# EAGLE design TriangleGenerator (EAGLE 7.3.0)
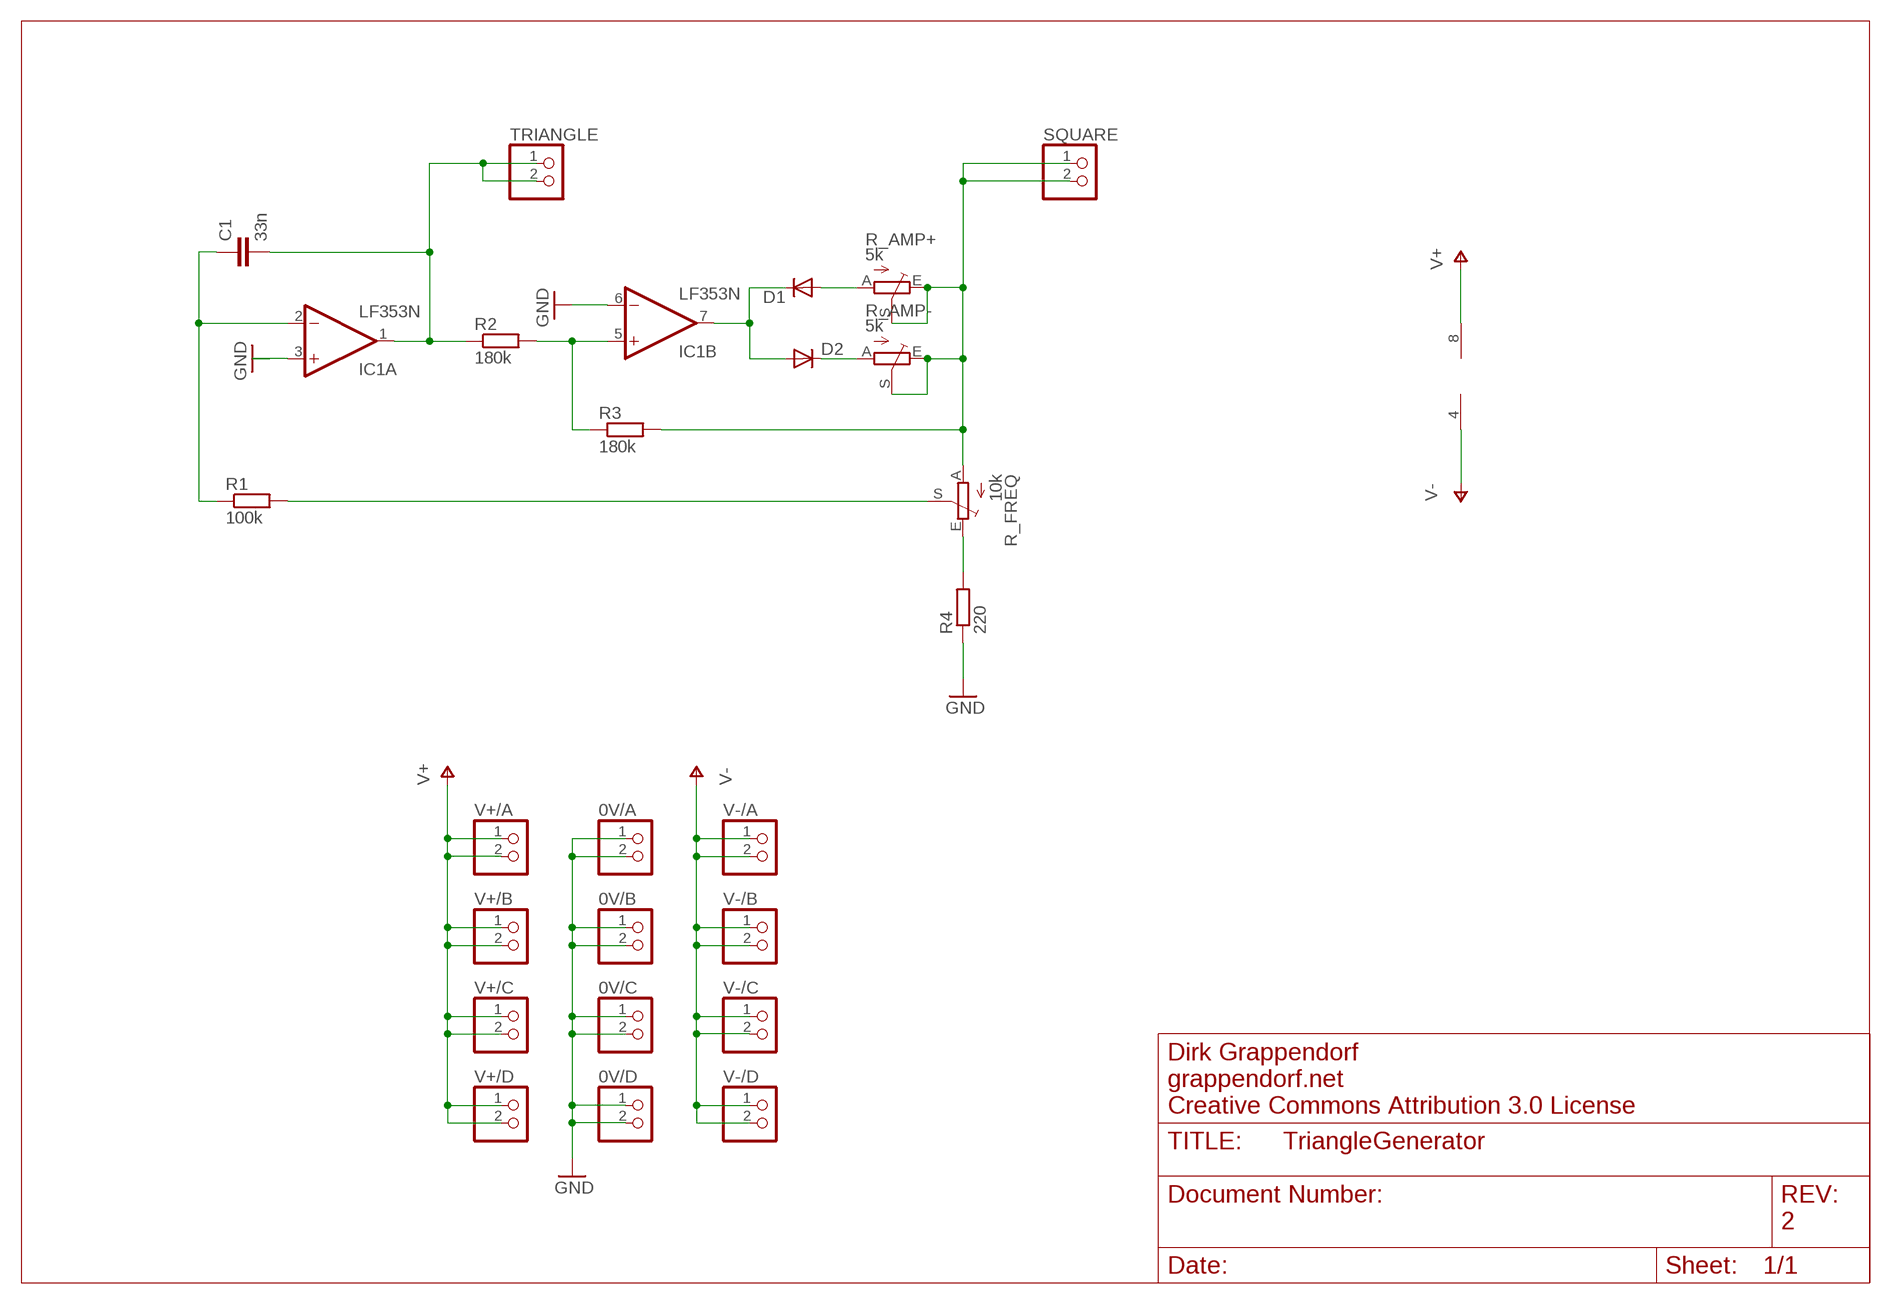
[diagram p0: schematic, sheet 1]

## Parts
0V/A  PINHD-1X2  [1X02]
0V/B  PINHD-1X2  [1X02]
0V/C  PINHD-1X2  [1X02]
0V/D  PINHD-1X2  [1X02]
C1  33n  C-EU025-025X050  [C025-025X050]
D1  DIODE1N4148  [DIODE-1N4148]
D2  DIODE1N4148  [DIODE-1N4148]
IC1  LF353N  [DIL08]
R1  100k  R-EU_0207/7  [0207/7]
R2  180k  R-EU_0207/7  [0207/7]
R3  180k  R-EU_0207/7  [0207/7]
R4  220  R-EU_0207/7  [0207/7]
R_AMP+  5k  TRIM_EU-LI15  [LI15]
R_AMP-  5k  TRIM_EU-LI15  [LI15]
R_FREQ  10k  TRIM_EU-LI15  [LI15]
SQUARE  PINHD-1X2  [1X02]
TRIANGLE  PINHD-1X2  [1X02]
V+/A  PINHD-1X2  [1X02]
V+/B  PINHD-1X2  [1X02]
V+/C  PINHD-1X2  [1X02]
V+/D  PINHD-1X2  [1X02]
V-/A  PINHD-1X2  [1X02]
V-/B  PINHD-1X2  [1X02]
V-/C  PINHD-1X2  [1X02]
V-/D  PINHD-1X2  [1X02]

## Nets
GND: 0V/A.1 0V/A.2 0V/B.1 0V/B.2 0V/C.1 0V/C.2 0V/D.1 0V/D.2 IC1.3(A:+IN) IC1.6(B:-IN) R4.1
N$1: C1.1 IC1.2(A:-IN) R1.1
N$2: C1.2 IC1.1(A:OUT) R2.1 TRIANGLE.1 TRIANGLE.2
N$3: IC1.5(B:+IN) R2.2 R3.1
N$4: D1.C D2.A IC1.7(B:OUT)
N$5: D1.A R_AMP+.A
N$6: D2.C R_AMP-.A
N$7: R3.2 R_AMP+.E R_AMP+.S R_AMP-.E R_AMP-.S R_FREQ.A SQUARE.1 SQUARE.2
N$10: R1.2 R_FREQ.S
N$11: R4.2 R_FREQ.E
V+: IC1.8(P:V+) V+/A.1 V+/A.2 V+/B.1 V+/B.2 V+/C.1 V+/C.2 V+/D.1 V+/D.2
V-: IC1.4(P:V-) V-/A.1 V-/A.2 V-/B.1 V-/B.2 V-/C.1 V-/C.2 V-/D.1 V-/D.2

## Notes on the sheet
- Dirk Grappendorf
- grappendorf.net
- Creative Commons Attribution 3.0 License
- 2

## Library data of the parts
0V/A 0V/B 0V/C 0V/D SQUARE TRIANGLE V+/A V+/B V+/C V+/D V-/A V-/B V-/C V-/D = pinhead:PINHD-1X2: PIN HEADER
C1 = rcl:C-EU: CAPACITOR, European symbol
D1 D2 = SparkFun:DIODE: Diode These are standard reverse protection diodes and small signal diodes. SMA package can handle up to about 1A. SOD-323 can handle about 200mA. What the SOD-323 package when ordering, there are some mfgs out there that are 5-pin packages.
IC1 = linear:LF353: OP AMP
R1-R4 = rcl:R-EU_: RESISTOR, European symbol
R_AMP+ R_AMP- R_FREQ = pot:TRIM_EU-: POTENTIOMETER

## Board
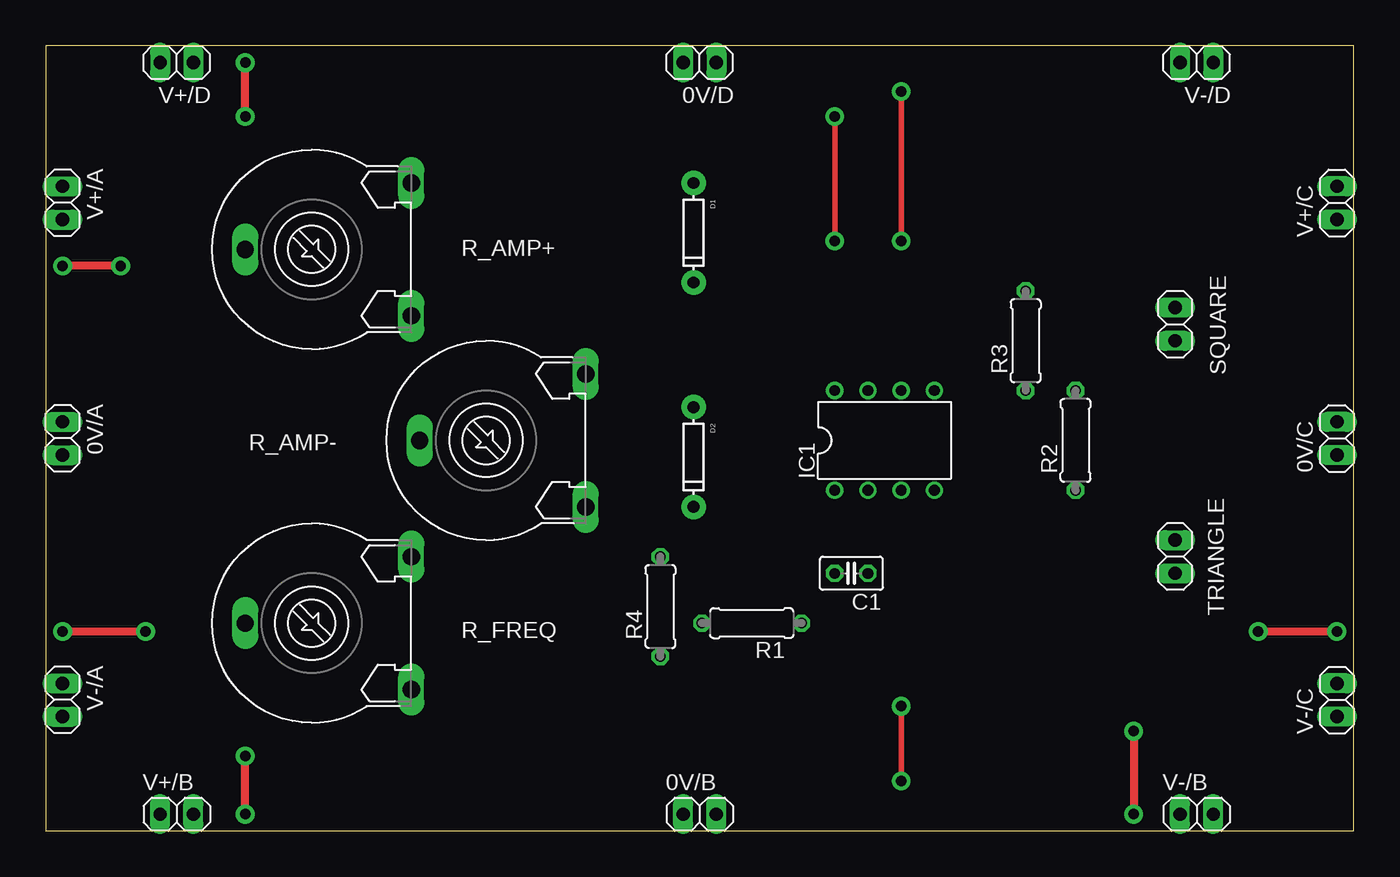
[diagram p1: board, top side]
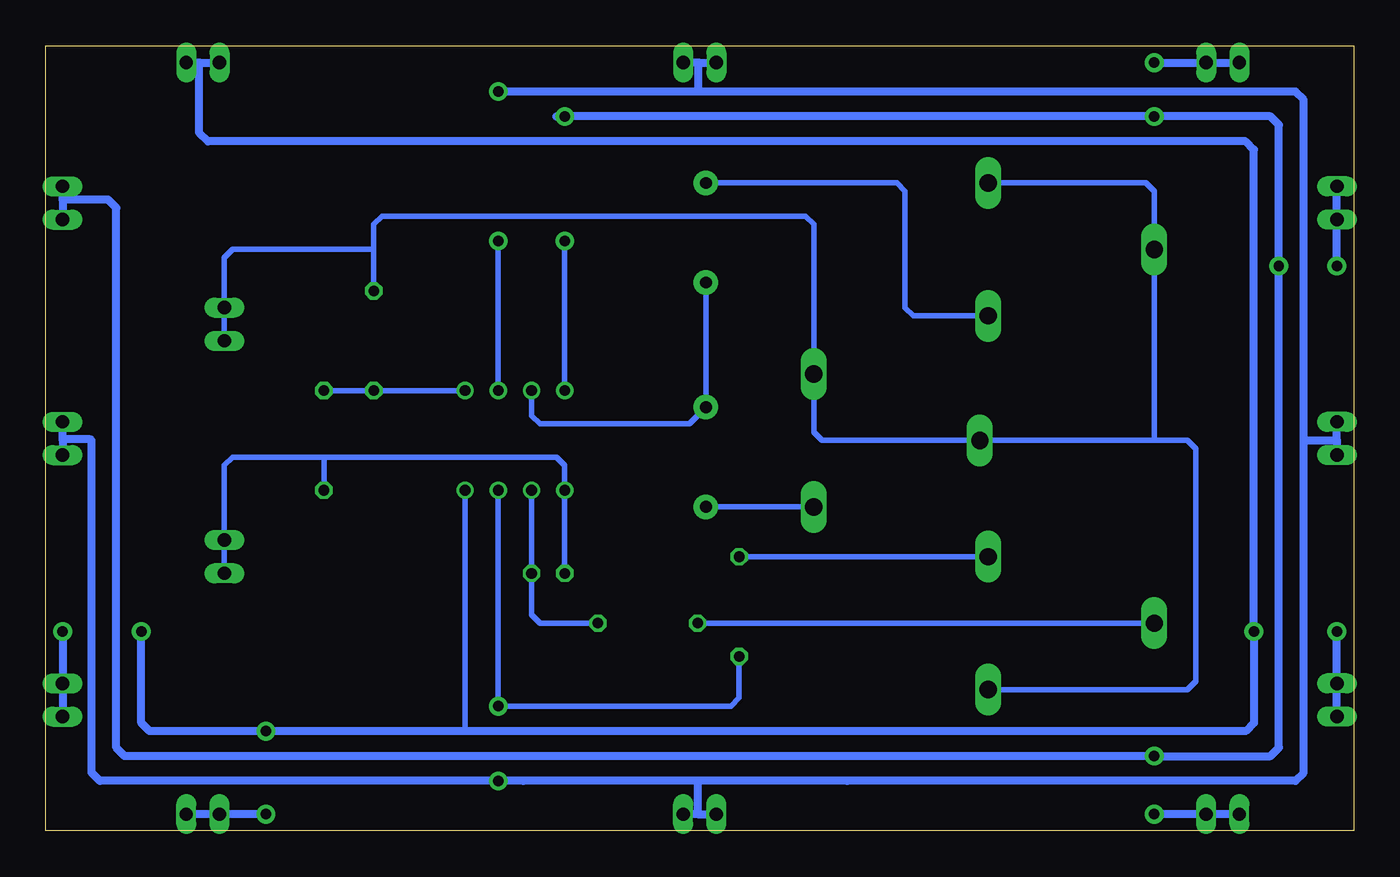
[diagram p2: board, bottom side, seen from below]

Size 100 x 60 mm. Coordinates in mm from the lower left corner, seen from the top.
Outline: 0,0 100,0 100,60 0,60 0,0
Copper layers (1*16): Top 0.035mm / dielectric 1.5mm / Bottom 0.035mm
Design rules "default *": minimum track width 10mil, minimum drill 24mil, track to track 8mil, track to pad 8mil, pad to pad 8mil, via to via 8mil, smd to smd 8mil, copper to edge 40mil, drill to drill 8mil, minimum pad ring 10mil, minimum via ring 8mil, stop-mask expansion 4mil, vias tented up to drill 0mil, thermal gap 10mil

### Footprints (pad centres in the part's own frame; a part is rotated, then mirrored left to right if it is on the bottom)
1X02 = drill 1.016 long: 1 -1.27,0; 2 1.27,0
C025-025X050 = drill 0.813 octagon: 1 -1.27,0; 2 1.27,0
DIODE-1N4148 = drill 0.9 pad 1.88: A -3.81,0; C 3.81,0
DIL08 = drill 0.813 pad 1.27: 1 -3.81,-3.81; 2 -1.27,-3.81; 3 1.27,-3.81; 4 3.81,-3.81; 5 3.81,3.81; 6 1.27,3.81; 7 -1.27,3.81; 8 -3.81,3.81
0207/7 = drill 0.813 octagon: 1 -3.81,0; 2 3.81,0
LI15 = drill 1.321 long: A -5.08,-7.62; E 5.08,-7.62; S 0,5.08

### Placement (x,y rotation side)
0V/A  1.27,30 270 top
0V/B  50,1.27 0 top
0V/C  98.73,30 90 top
0V/D  50,58.73 180 top
C1  61.59,19.68 180 top
D1  49.53,45.72 270 top
D2  49.53,28.57 270 top
IC1  64.14,29.84 0 top
R1  53.98,15.88 180 top
R2  78.74,29.84 90 top
R3  74.93,37.47 90 top
R4  46.99,17.14 90 top
R_AMP+  20.32,44.45 90 top
R_AMP-  33.66,29.84 90 top
R_FREQ  20.32,15.88 90 top
SQUARE  86.36,38.73 90 top
TRIANGLE  86.36,20.95 270 top
V+/A  1.27,48 270 top
V+/B  10,1.27 0 top
V+/C  98.73,48 90 top
V+/D  10,58.73 180 top
V-/A  1.27,10 270 top
V-/B  88,1.27 0 top
V-/C  98.73,10 90 top
V-/D  88,58.73 180 top

### Tracks (layer width: path | path; a pad name or v marks a point on that pad's centre or on a via)
GND  (via drill 0.8)
  Top 0.406: v65.41,3.81 v65.41,9.53 | v65.41,56.52 v65.41,45.09
  Bottom 0.406: v65.41,45.09 IC1.6 | R4.1 46.99,10.16 47.62,9.53 v65.41,9.53 IC1.3 | 63.5,3.81 v65.41,3.81
  Bottom 0.61: 1.27,29.84 0V/A.2 | 1.27,29.84 0V/A.1 | 50.08,58.73 0V/D.2 | 50.08,58.73 0V/D.1 | 98.73,29.93 0V/C.1 98.48,28.48 | 98.73,29.93 0V/C.2 | 50.16,1.27 0V/B.1 | 50.16,1.27 0V/B.2 | 3.81,29.84 3.81,5.08 3.81,4.45 4.45,3.81 38.73,3.81 50.16,3.81 | 3.81,29.84 3.81,55.88 4.45,56.52 50.16,56.52 | 50.16,3.81 63.5,3.81 v65.41,3.81 95.89,3.81 96.52,4.45 96.52,29.84 96.6,29.93 98.73,29.93 | 50.16,56.52 v65.41,56.52 | 3.81,29.84 1.27,29.84 | 50.16,3.81 50.16,1.27 | 50.08,58.73 50.08,56.6 50.16,56.52
N$1
  Bottom 0.406: IC1.2 C1.1 62.87,16.51 62.23,15.88 R1.1
N$2
  Bottom 0.406: 78.74,28.57 60.96,28.57 60.33,27.94 IC1.1 C1.2 | 78.74,28.57 85.72,28.57 86.36,27.94 TRIANGLE.1 TRIANGLE.2 | 78.74,28.57 R2.1
N$3
  Bottom 0.406: IC1.5 R3.1 R2.2
N$4
  Bottom 0.406: D1.C D2.A 50.8,31.11 62.23,31.11 62.87,31.75 IC1.7
N$5
  Bottom 0.406: R_AMP+.A 33.66,39.37 34.29,40.01 34.29,48.9 34.92,49.53 D1.A
N$6
  Bottom 0.406: R_AMP-.A D2.C
N$7
  Bottom 0.406: R_AMP+.E 15.88,49.53 15.24,48.9 R_AMP+.S 15.24,29.84 | R_FREQ.A 12.7,10.79 12.06,11.43 12.06,29.21 12.7,29.84 15.24,29.84 | 15.24,29.84 R_AMP-.S 40.64,29.84 41.27,30.48 R_AMP-.E 41.27,46.35 41.91,46.99 74.3,46.99 74.93,46.35 74.93,44.45 | 74.93,44.45 R3.2 | SQUARE.1 SQUARE.2 86.36,43.81 85.72,44.45 74.93,44.45
N$10
  Bottom 0.406: R_FREQ.S R1.2
N$11
  Bottom 0.406: R_FREQ.E R4.2
V+  (via drill 0.8)
  Top 0.406: v60.33,54.61 v60.33,45.09
  Top 0.61: v5.71,43.18 v1.27,43.18 | v15.24,1.27 v15.24,5.71 | v15.24,54.61 v15.24,58.73
  Bottom 0.406: v60.33,45.09 IC1.8
  Bottom 0.61: v1.27,43.18 V+/A.2 V+/A.1 | V+/D.2 V+/D.1 14.91,58.73 v15.24,58.73 | 98.73,48.26 V+/C.1 | 98.73,48.26 V+/C.2 | V+/B.1 V+/B.2 15.05,1.27 v15.24,1.27 | v5.71,43.18 5.71,6.35 6.35,5.71 v15.24,5.71 20.32,5.71 61.59,5.71 93.98,5.71 94.61,6.35 94.61,47.62 95.25,48.26 98.73,48.26 | v5.71,43.18 5.71,43.72 | 60.96,54.61 v60.33,54.61 v15.24,54.61 6.35,54.61 5.71,53.98 v5.71,43.18
V-  (via drill 0.8)
  Top 0.61: v1.27,15.24 v7.62,15.24 | v92.71,15.24 v98.73,15.24 | v83.19,7.62 v83.19,1.27
  Bottom 0.406: 67.85,7.71 67.94,7.62 IC1.4
  Bottom 0.61: V-/A.2 V-/A.1 1.27,15.05 v1.27,15.24 | V-/C.1 V-/C.2 98.73,14.91 v98.73,15.24 | V-/B.2 V-/B.1 v83.19,1.27 | 88.27,58.73 V-/D.2 | 88.27,58.73 V-/D.1 | v92.71,15.24 92.71,8.26 92.08,7.62 v83.19,7.62 67.94,7.62 41.91,7.62 8.26,7.62 7.62,8.26 v7.62,15.24 7.62,52.07 8.26,52.7 87.63,52.7 88.27,53.34 88.27,58.73